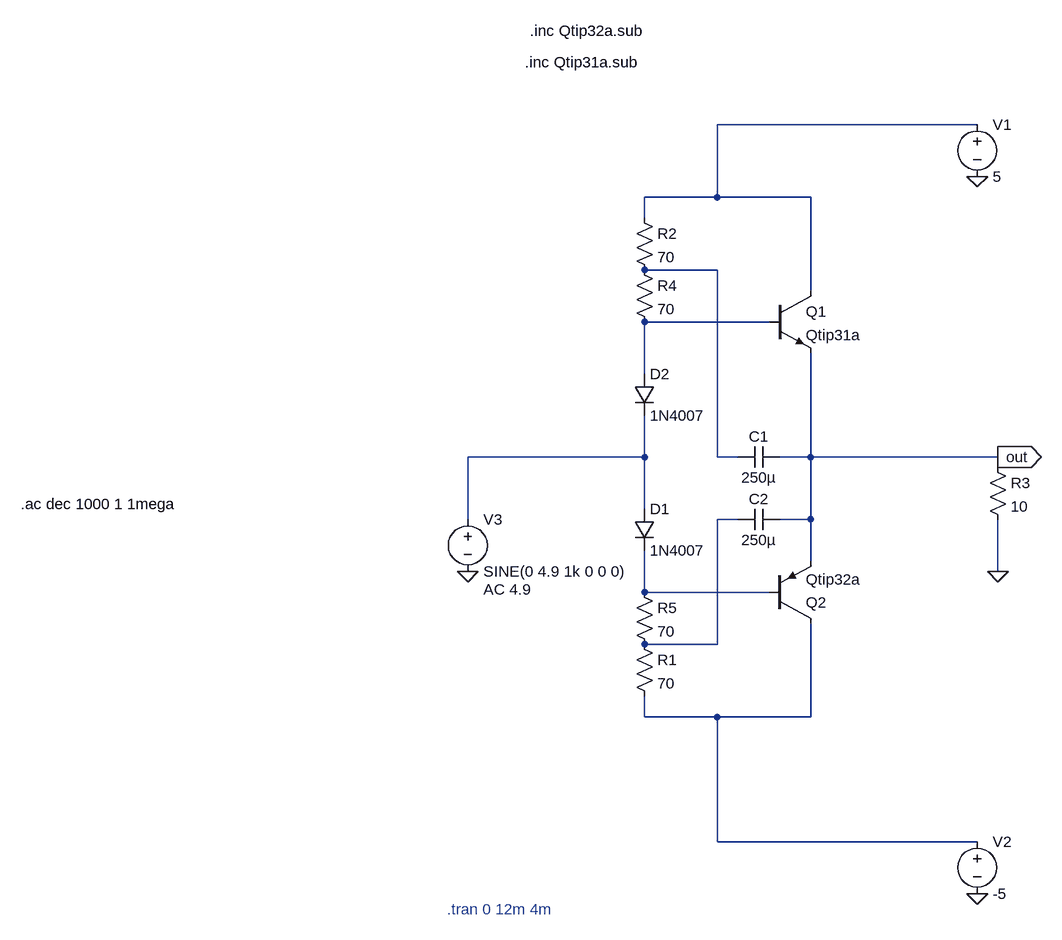
[diagram p0: schematic Power Ampilifier.asc]
Power Ampilifier.asc, the LTspice schematic file:
Version 4.1
SHEET 1 880 1272
WIRE 752 48 352 48
WIRE 352 160 352 48
WIRE 352 160 240 160
WIRE 496 160 352 160
WIRE 240 192 240 160
WIRE 352 272 240 272
WIRE 496 304 496 160
WIRE 432 352 240 352
WIRE 240 432 240 352
WIRE 240 560 240 496
WIRE 240 560 -32 560
WIRE 352 560 352 272
WIRE 384 560 352 560
WIRE 496 560 496 400
WIRE 496 560 448 560
WIRE 784 560 496 560
WIRE 784 576 784 560
WIRE 240 640 240 560
WIRE -32 656 -32 560
WIRE 384 656 352 656
WIRE 496 656 496 560
WIRE 496 656 448 656
WIRE 496 720 496 656
WIRE 784 736 784 656
WIRE 240 768 240 704
WIRE 432 768 240 768
WIRE 352 848 352 656
WIRE 352 848 240 848
WIRE 240 960 240 928
WIRE 352 960 240 960
WIRE 496 960 496 816
WIRE 496 960 352 960
WIRE 352 1152 352 960
WIRE 752 1152 352 1152
FLAG 784 736 0
FLAG 752 128 0
FLAG 752 1232 0
FLAG 784 560 out
IOPIN 784 560 Out
FLAG -32 736 0
DATAFLAG 48 560 ""
SYMBOL res 224 832 R0
SYMATTR InstName R1
SYMATTR Value 70
SYMBOL res 224 176 R0
SYMATTR InstName R2
SYMATTR Value 70
SYMBOL npn 432 304 R0
SYMATTR InstName Q1
SYMATTR Value Qtip31a
SYMBOL pnp 432 816 M180
SYMATTR InstName Q2
SYMATTR Value Qtip32a
SYMBOL res 768 560 R0
SYMATTR InstName R3
SYMATTR Value 10
SYMBOL voltage 752 32 R0
WINDOW 123 0 0 Left 0
WINDOW 39 0 0 Left 0
SYMATTR InstName V1
SYMATTR Value 5
SYMBOL voltage 752 1136 R0
WINDOW 123 0 0 Left 0
WINDOW 39 0 0 Left 0
SYMATTR InstName V2
SYMATTR Value -5
SYMBOL diode 224 640 R0
SYMATTR InstName D1
SYMATTR Value 1N4007
SYMBOL diode 224 432 R0
SYMATTR InstName D2
SYMATTR Value 1N4007
SYMBOL cap 448 544 R90
WINDOW 0 0 32 VBottom 2
WINDOW 3 32 32 VTop 2
SYMATTR InstName C1
SYMATTR Value 250µ
SYMBOL res 224 256 R0
SYMATTR InstName R4
SYMATTR Value 70
SYMBOL res 224 752 R0
SYMATTR InstName R5
SYMATTR Value 70
SYMBOL cap 448 640 R90
WINDOW 0 0 32 VBottom 2
WINDOW 3 32 32 VTop 2
SYMATTR InstName C2
SYMATTR Value 250µ
SYMBOL voltage -32 640 R0
WINDOW 123 24 124 Left 2
WINDOW 39 0 0 Left 0
SYMATTR Value2 AC 4.9
SYMATTR InstName V3
SYMATTR Value SINE(0 4.9 1k 0 0 0)
TEXT -64 1256 Left 2 ;.tran 0 12m 4m
TEXT 56 -48 Left 2 !.inc Qtip31a.sub
TEXT 64 -96 Left 2 !.inc Qtip32a.sub
TEXT -720 632 Left 2 !.ac dec 1000 1 1mega

The netlist it stands for:
* Power Ampilifier.asc
R1 N005 N007 70
R2 N001 N002 70
Q1 N001 N003 out 0 Qtip31a
Q2 N007 N006 out 0 Qtip32a
R3 out 0 10
V1 N001 0 5
V2 N007 0 -5
D1 N004 N006 1N4007
D2 N003 N004 1N4007
C1 out N002 250µ
R4 N002 N003 70
R5 N006 N005 70
C2 out N005 250µ
V3 N004 0 SINE(0 4.9 1k 0 0 0) AC 4.9
.model D D
.lib standard.dio
.model NPN NPN
.model PNP PNP
.lib standard.bjt
* .tran 0 12m 4m
.inc Qtip31a.sub
.inc Qtip32a.sub
.ac dec 1000 1 1mega
.backanno
.end